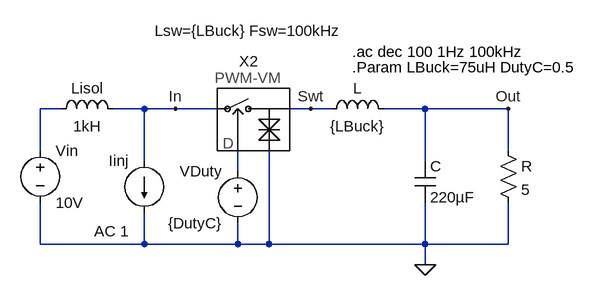
[diagram p0: schematic Buck-VM-Input Impedance Open.asc]
Buck-VM-Input Impedance Open.asc, the LTspice schematic file:
Version 4
SHEET 1 880 696
WIRE -160 48 -192 48
WIRE -32 48 -80 48
WIRE 16 48 -32 48
WIRE 80 48 16 48
WIRE 224 48 192 48
WIRE 256 48 224 48
WIRE 400 48 336 48
WIRE 528 48 400 48
WIRE -192 112 -192 48
WIRE 528 112 528 48
WIRE -32 128 -32 48
WIRE 400 128 400 48
WIRE 112 144 112 112
WIRE -192 256 -192 192
WIRE -32 256 -32 208
WIRE -32 256 -192 256
WIRE 112 256 112 224
WIRE 112 256 -32 256
WIRE 160 256 160 112
WIRE 160 256 112 256
WIRE 400 256 400 192
WIRE 400 256 160 256
WIRE 528 256 528 192
WIRE 528 256 400 256
WIRE 400 288 400 256
FLAG 400 288 0
FLAG 16 48 In
FLAG 528 48 Out
FLAG 224 48 Swt
SYMBOL voltage -192 96 R0
WINDOW 123 24 124 Left 2
WINDOW 39 0 0 Left 2
SYMATTR InstName Vin
SYMATTR Value 10V
SYMBOL ind 240 64 R270
WINDOW 0 32 56 VTop 2
WINDOW 3 5 56 VBottom 2
SYMATTR InstName L
SYMATTR Value {LBuck}
SYMBOL cap 384 128 R0
SYMATTR InstName C
SYMATTR Value 220µF
SYMATTR SpiceLine Rser=70m
SYMBOL res 512 96 R0
SYMATTR InstName R
SYMATTR Value 5
SYMBOL PWM-VM 128 64 R0
WINDOW 39 0 -112 Invisible 2
SYMATTR InstName X2
SYMATTR SpiceLine2 Lsw={LBuck} Fsw=100kHz
SYMBOL voltage 112 128 M0
SYMATTR InstName VDuty
SYMATTR Value {DutyC}
SYMBOL current -32 128 M0
WINDOW 123 24 108 Left 2
WINDOW 39 0 0 Left 2
SYMATTR Value2 AC 1
SYMATTR InstName Iinj
SYMATTR Value ""
SYMBOL ind -176 64 R270
WINDOW 0 32 56 VTop 2
WINDOW 3 5 56 VBottom 2
SYMATTR InstName Lisol
SYMATTR Value 1kH
TEXT 288 -16 Left 2 !.Param LBuck=75uH DutyC=0.5
TEXT 288 -40 Left 2 !.ac dec 100 1Hz 100kHz

The netlist it stands for:
* Buck-VM-Input Impedance Open.asc
Vin N001 0 10V
L Swt Out {LBuck}
C Out 0 220µF Rser=70m
R Out 0 5
XX2 In Swt 0 N002 PWM-VM params: DCMin=0.05 DCMax=0.95 Lsw={LBuck} Fsw=100kHz  ; pins nA nC nP nD
VDuty N002 0 {DutyC}
Iinj In 0 AC 1
Lisol N001 In 1kH
.Param LBuck=75uH DutyC=0.5
.ac dec 100 1Hz 100kHz
.backanno
.end